# EAGLE schematic MotorAndRelayTest_v0.1_v1 (EAGLE 9.7.0)
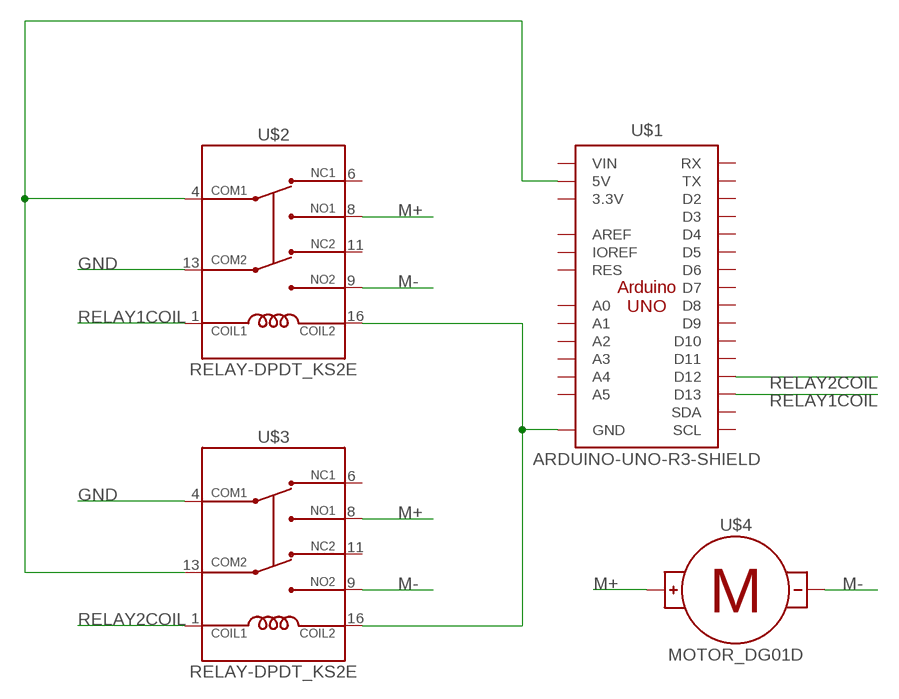
[diagram p0: schematic, sheet 1]

## Parts
U$1  ARDUINO-UNO-R3-SHIELD  [ARDUINO-UNO-R3-SHIELD]
U$2  RELAY-DPDT_KS2E  [KS2E-M-DC5]
U$3  RELAY-DPDT_KS2E  [KS2E-M-DC5]
U$4  MOTOR_DG01D  [DG01D]

## Nets
GND: U$2.13(COM2) U$3.4(COM1)
M+: U$2.8(NO1) U$3.8(NO1) U$4.+
M-: U$2.9(NO2) U$3.9(NO2) U$4.-
N$1: U$1.5V U$2.4(COM1) U$3.13(COM2)
N$3: U$1.GND@0(GND) U$1.GND@1(GND) U$1.GND@2(GND) U$2.16(COIL2) U$3.16(COIL2)
RELAY1COIL: U$1.D13 U$2.1(COIL1)
RELAY2COIL: U$1.D12 U$3.1(COIL1)
Unconnected: U$1.3.3V U$1.A0 U$1.A1 U$1.A2 U$1.A3 U$1.A4 U$1.A5 U$1.AREF U$1.D2 U$1.D3 U$1.D4 U$1.D5 U$1.D6 U$1.D7 U$1.D8 U$1.D9 U$1.D10 U$1.D11 U$1.IOREF U$1.RES U$1.RX U$1.SCL U$1.SDA U$1.TX U$1.VIN U$2.6(NC1) U$2.11(NC2) U$3.6(NC1) U$3.11(NC2)

## Library data of the parts
U$1 = Tinkercad:ARDUINO-UNO-R3-SHIELD
U$2 U$3 = Tinkercad:RELAY-DPDT
U$4 = Tinkercad:MOTOR